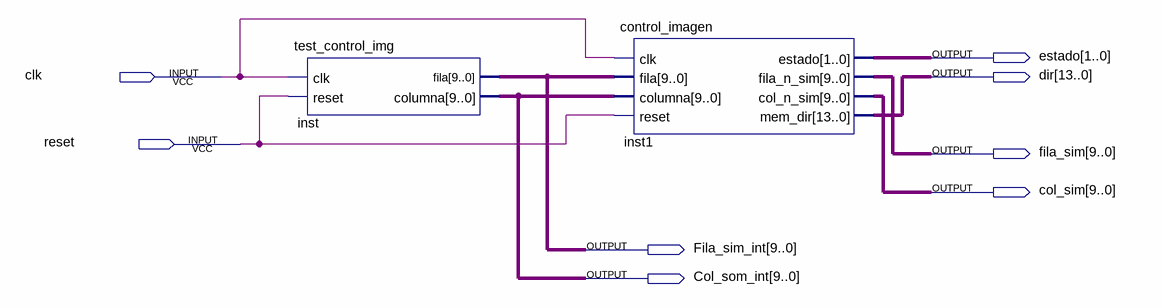
[diagram p0: schematic sheet]
// Quartus schematic Test_cont_img.bdf as structural Verilog: 2 symbols, 8 pins
module Test_cont_img (
  input  clk,
  input  reset,
  output [1:0] estado,
  output [13:0] dir,
  output [9:0] fila_sim,
  output [9:0] col_sim,
  output [9:0] Fila_sim_int,
  output [9:0] Col_som_int
);

  test_control_img inst (.clk(clk), .reset(reset), .fila(Fila_sim_int), .columna(Col_som_int));
  control_imagen inst1 (
    .clk(clk), .fila(Fila_sim_int), .columna(Col_som_int), .reset(reset), .estado(estado),
    .fila_n_sim(fila_sim), .col_n_sim(col_sim), .mem_dir(dir));
endmodule
